# EAGLE design Jemuran (EAGLE 7.7.0)
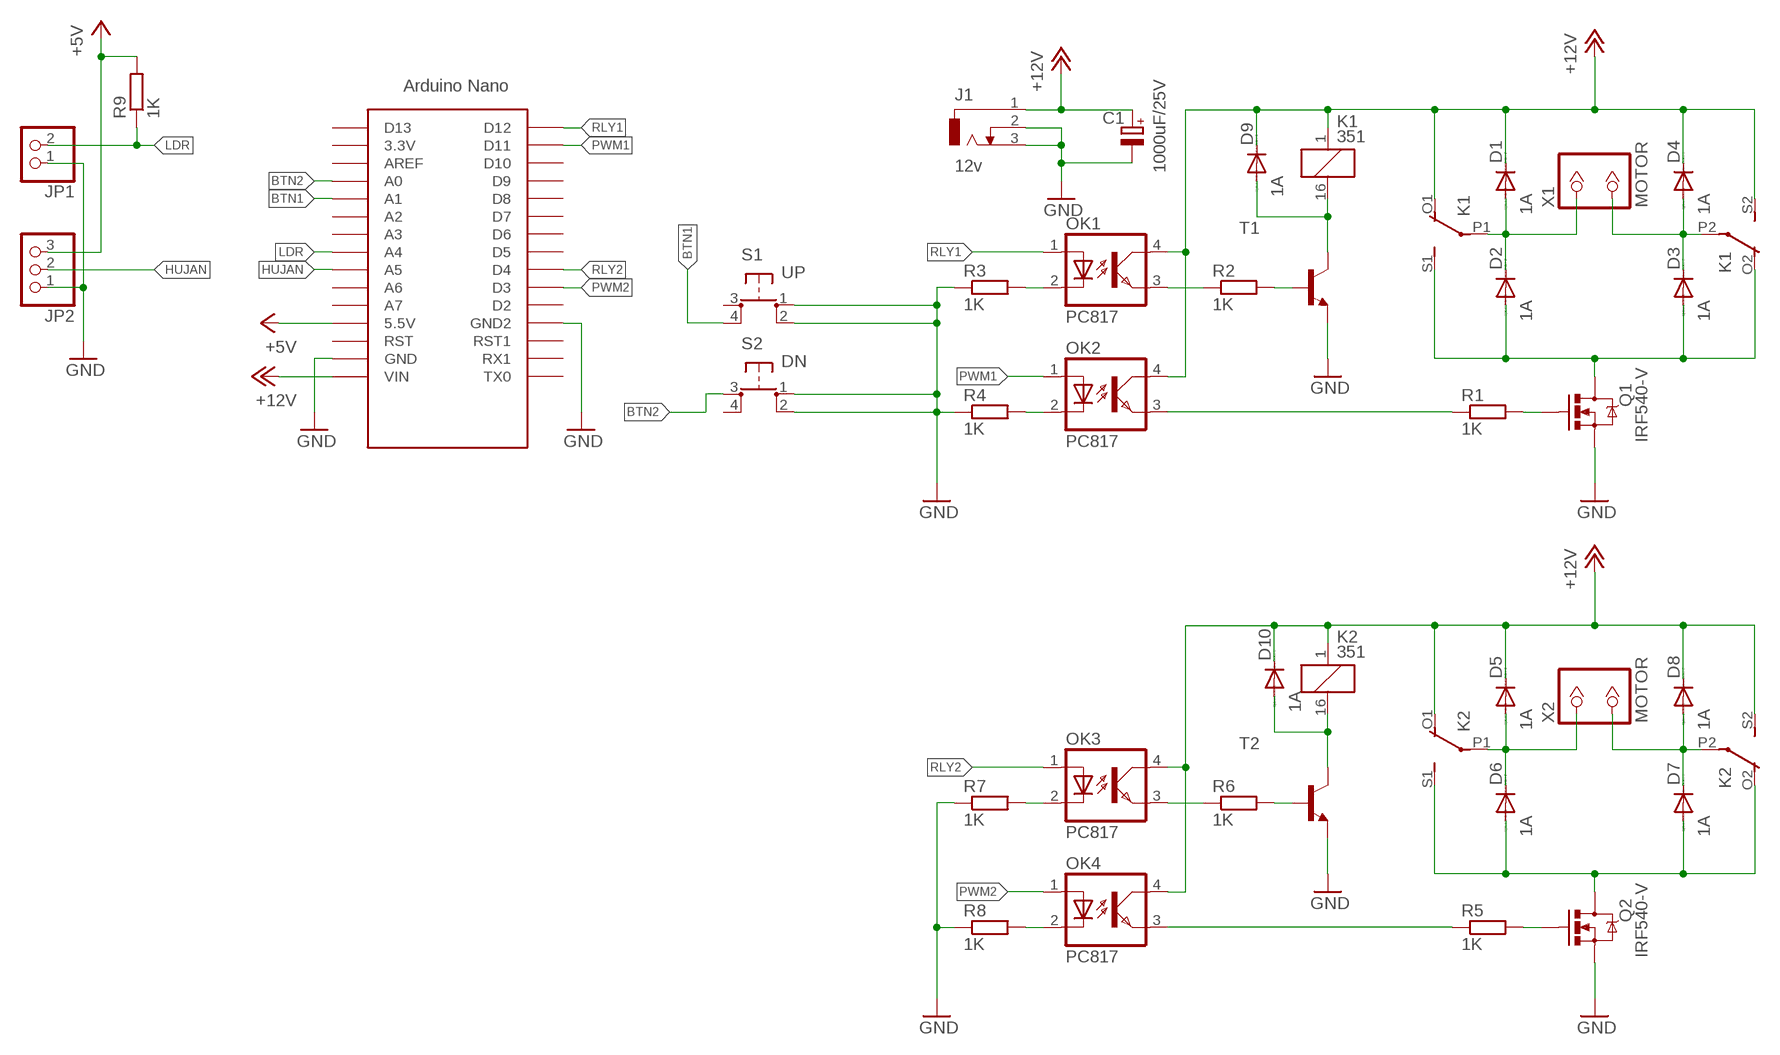
[diagram p0: schematic, sheet 1]

## Parts
C1  1000uF/25V  CPOL-EUE3.5-10  [E3,5-10]
D1  1A  DIODE-DIP-1A  [D40-10]
D2  1A  DIODE-DIP-1A  [D40-10]
D3  1A  DIODE-DIP-1A  [D40-10]
D4  1A  DIODE-DIP-1A  [D40-10]
D5  1A  DIODE-DIP-1A  [D40-10]
D6  1A  DIODE-DIP-1A  [D40-10]
D7  1A  DIODE-DIP-1A  [D40-10]
D8  1A  DIODE-DIP-1A  [D40-10]
D9  1A  DIODE-DIP-1A  [D40-10]
D10  1A  DIODE-DIP-1A  [D40-10]
J1  12v  JACK-PCB-ARDUINO  [JACK-PCB-ARDUINO]
JP1  PINHD-1X2  [1X02]
JP2  PINHD-1X3  [1X03]
K1  351  [351]
K2  351  [351]
OK1  PC817  [DIL04]
OK2  PC817  [DIL04]
OK3  PC817  [DIL04]
OK4  PC817  [DIL04]
Q1  IRF540-V  [TO220V]
Q2  IRF540-V  [TO220V]
R1  1K  R-EU_0207/7  [0207/7]
R2  1K  R-EU_0207/7  [0207/7]
R3  1K  R-EU_0207/7  [0207/7]
R4  1K  R-EU_0207/7  [0207/7]
R5  1K  R-EU_0207/7  [0207/7]
R6  1K  R-EU_0207/7  [0207/7]
R7  1K  R-EU_0207/7  [0207/7]
R8  1K  R-EU_0207/7  [0207/7]
R9  1K  R-EU_0207/7  [0207/7]
S1  UP  TACT-6X6OCT  [TACT-6X6MM-OCTAGON]
S2  DN  TACT-6X6OCT  [TACT-6X6MM-OCTAGON]
T1  -NPN-TO92-EBC  [TO92-EBC]
T2  -NPN-TO92-EBC  [TO92-EBC]
U$1  NANO  [NANO]
X1  MOTOR  2PIN-SCREW  [KL2]
X2  MOTOR  2PIN-SCREW  [KL2]

## Nets
+5V: JP2.3 R9.2 U$1.5V(5.5V)
+12V: C1.+ D1.C D4.C D5.C D8.C D9.C D10.C J1.1 K1.1 K1.O1(2:O) K1.S2(3:S) K2.1 K2.O1(2:O) K2.S2(3:S) OK1.4(COL) OK2.4(COL) OK3.4(COL) OK4.4(COL) U$1.VIN
BTN1: S1.4(P1) U$1.A1
BTN2: S2.3(P) U$1.A0
GND: C1.- J1.2 J1.3 JP1.1 JP2.1 Q1.3(S) Q2.3(S) R3.1 R4.1 R7.1 R8.1 S1.1(S) S1.2(S1) S2.1(S) S2.2(S1) T1.E T2.E U$1.GND U$1.GND1(GND2)
HUJAN: JP2.2 U$1.A5
LDR: JP1.2 R9.1 U$1.A4
N$1: Q1.1(G) R1.2
N$2: D2.A D3.A K1.O2(3:O) K1.S1(2:S) Q1.2(D)
N$3: D1.A D2.C K1.P1(2:P) X1.1
N$4: D3.C D4.A K1.P2(3:P) X1.2
N$5: OK2.3(EMIT) R1.1
N$6: D9.A K1.16 T1.C
N$7: R2.2 T1.B
N$8: OK1.2(C) R3.2
N$9: OK1.3(EMIT) R2.1
N$10: OK2.2(C) R4.2
N$11: D6.A D7.A K2.O2(3:O) K2.S1(2:S) Q2.2(D)
N$12: D5.A D6.C K2.P1(2:P) X2.1
N$13: D7.C D8.A K2.P2(3:P) X2.2
N$14: Q2.1(G) R5.2
N$15: OK4.3(EMIT) R5.1
N$16: D10.A K2.16 T2.C
N$17: R6.2 T2.B
N$18: OK3.3(EMIT) R6.1
N$19: OK3.2(C) R7.2
N$20: OK4.2(C) R8.2
PWM1: OK2.1(A) U$1.D11
PWM2: OK4.1(A) U$1.D3
RLY1: OK1.1(A) U$1.D12
RLY2: OK3.1(A) U$1.D4
Unconnected: S1.3(P) S2.4(P1) U$1.3.3V U$1.A2 U$1.A3 U$1.A6 U$1.A7 U$1.AREF U$1.D2 U$1.D5 U$1.D6 U$1.D7 U$1.D8 U$1.D9 U$1.D10 U$1.D13 U$1.RST U$1.RST1 U$1.RX1 U$1.TX0

## Library data of the parts
C1 = FansElectronics-RCL:CPOL-EU: POLARIZED CAPACITOR, European symbol
D1-D10 = FansElectronics-Diode:DIODE-DIP
J1 = FansElectronics-Con-Jack:JACK-PCB-ARDUINO: 2 Lubang PCB Jack
JP1 = FansElectronics-Header:PINHD-1X2: PIN HEADER
JP2 = FansElectronics-Header:PINHD-1X3: PIN HEADER
K1 K2 = relay:351: RELAY 2 x switch, Omron; OC_FARNELL: unknown; OC_NEWARK: unknown
OK1-OK4 = optocoupler:PC817: SHARP OPTO COUPLER; MPN: PC817X4J000F; OC_FARNELL: 9707727; OC_NEWARK: 97K7059
Q1 Q2 = FansElectronics-Mosfet:IRF540
R1-R9 = FansElectronics-RCL:R-EU_: RESISTOR, European symbol
S1 S2 = FansElectronics-Switch:TACT: TACT SWITCH biasa juga disebut Switch Omron / Micro Switch
T1 T2 = transistor:*-NPN-: NPN Transistror BF959 corrected 2008.03.06
U$1 = Arduino-clone:NANO: Arduino Nano
X1 X2 = FansElectronics-Con-Screw:2PIN

## Board
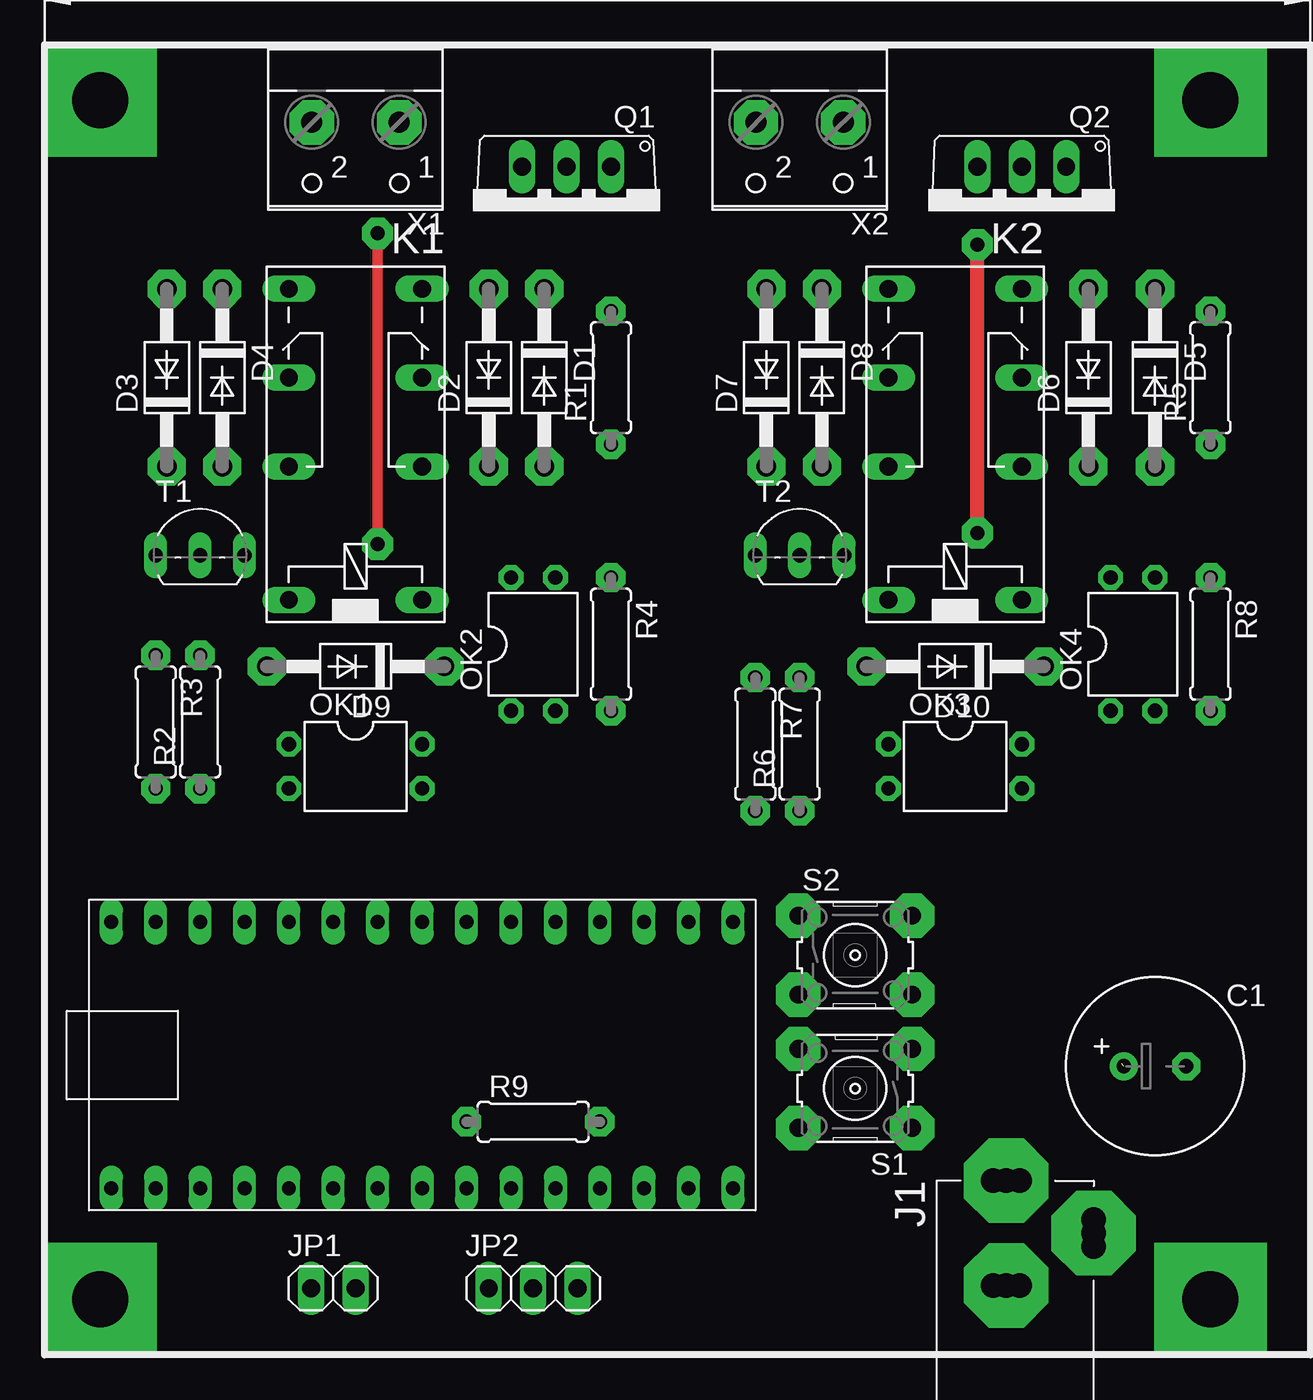
[diagram p1: board, top side]
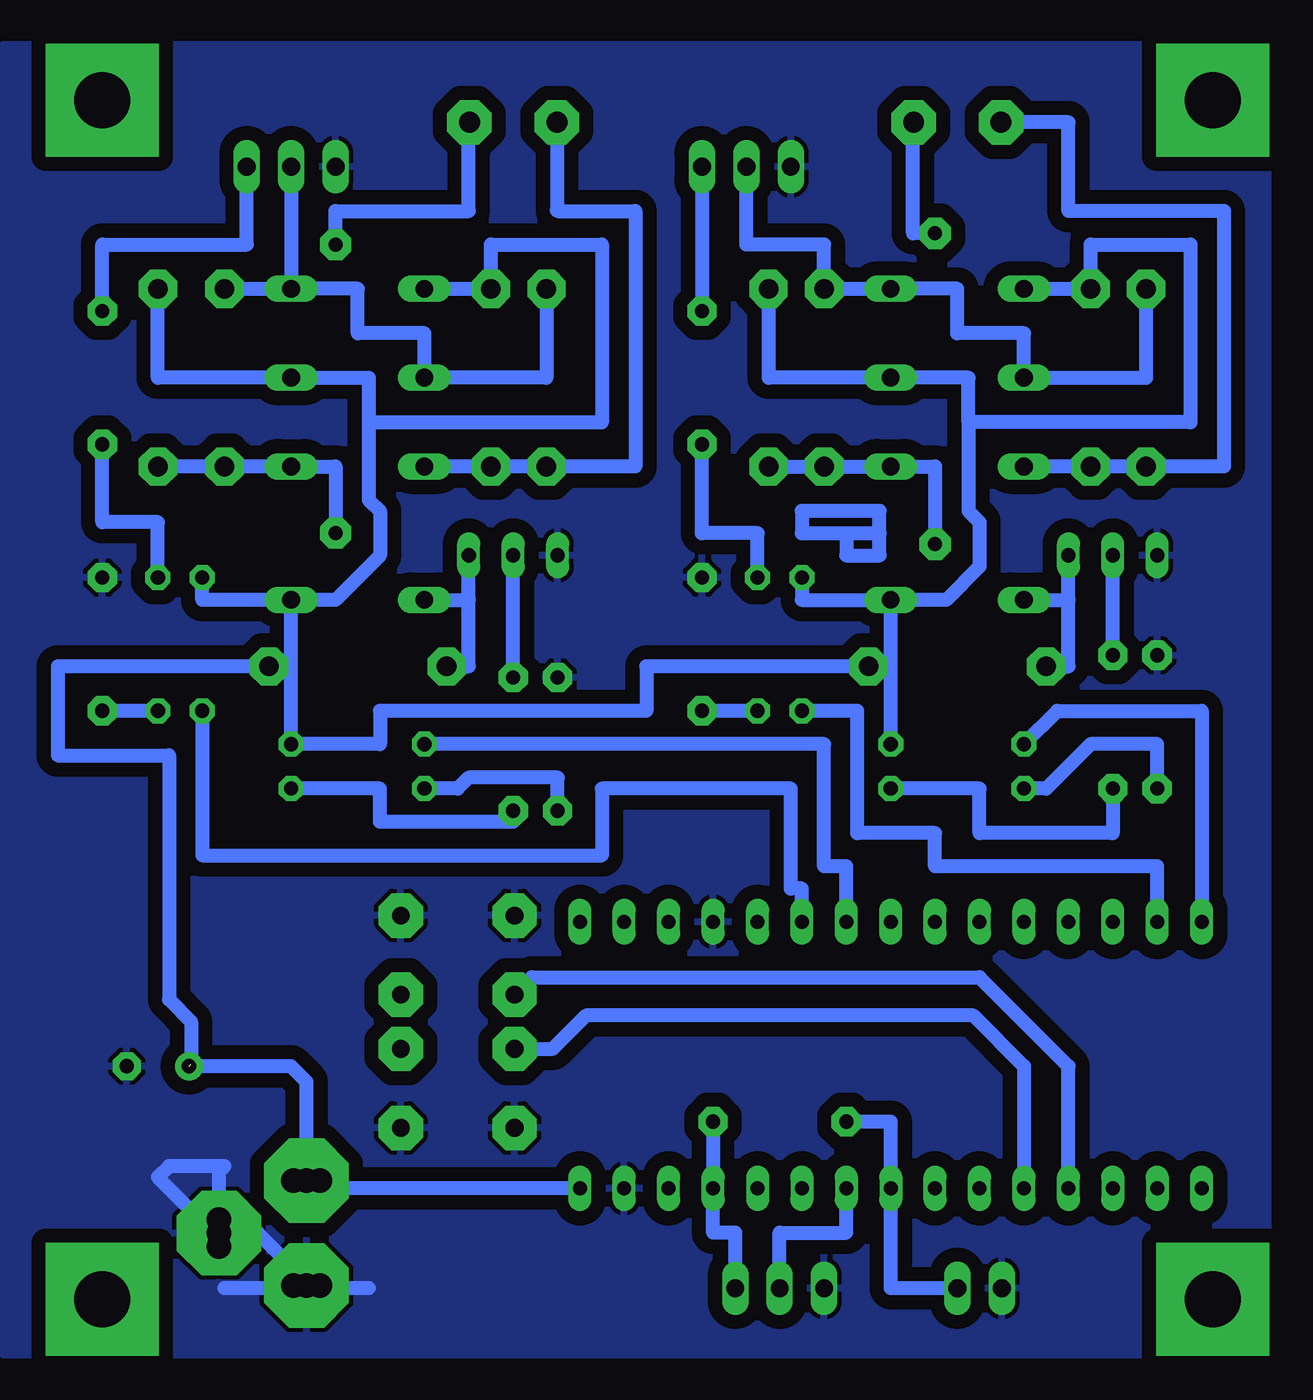
[diagram p2: board, bottom side, seen from below]

No outline drawn. Coordinates in mm, seen from the top.
Copper layers (1*16): Top 0.035mm / dielectric 1.5mm / Bottom 0.035mm
Design rules "default": minimum track width 10mil, minimum drill 24mil, track to track 8mil, track to pad 8mil, pad to pad 8mil, via to via 8mil, smd to smd 8mil, copper to edge 40mil, drill to drill 8mil, minimum pad ring 10mil, minimum via ring 8mil, stop-mask expansion 4mil, vias tented up to drill 0mil, thermal gap 10mil

### Footprints (pad centres in the part's own frame; a part is rotated, then mirrored left to right if it is on the bottom)
E3,5-10 = drill 0.813 pad 1.6: + -1.778,0 | drill 0.813 pad 1.6 octagon: - 1.778,0
D40-10 = drill 1.118 pad 2.184 octagon: A 5.08,0; C -5.08,0
JACK-PCB-ARDUINO = drill 1.4 pad 4.826 octagon: 1 -0.25,2.978; 2 4.754,-0.019; 3 -0.25,-3.016 | drill 1.4: 4 -1.012,2.978; 5 0.512,2.978; 6 4.754,0.743; 7 4.754,-0.781; 8 -1.012,-3.016; 9 0.512,-3.016
1X02 = drill 1.016 long: 1 -1.27,0; 2 1.27,0
1X03 = drill 1.016 long: 1 -2.54,0; 2 0,0; 3 2.54,0
351 = drill 1.016 long: 1 -3.81,-3.81; 16 -3.81,3.81; O1 8.89,-3.81; O2 8.89,3.81; P1 3.81,-3.81; P2 3.81,3.81; S1 13.97,-3.81; S2 13.97,3.81
DIL04 = drill 0.813 pad 1.422 octagon: 1 -1.27,-3.81; 2 1.27,-3.81; 3 1.27,3.81; 4 -1.27,3.81
TO220V = drill 1.016 long: 1 -2.54,0; 2 0,0; 3 2.54,0
0207/7 = drill 0.813 pad 1.676 octagon: 1 -3.81,0; 2 3.81,0
TACT-6X6MM-OCTAGON = drill 1.016 pad 2.54 octagon: 1 -3.251,2.261; 2 3.251,2.261; 3 -3.251,-2.261; 4 3.251,-2.261
TO92-EBC = drill 0.813 long: B 0,-1.27; C 2.54,-1.27; E -2.54,-1.27
NANO = drill 0.8 long: 3.3V -10.16,24.13; 5V -10.16,-1.27; A0 -10.16,19.05; A1 -10.16,16.51; A2 -10.16,13.97; A3 -10.16,11.43; A4 -10.16,8.89; A5 -10.16,6.35; A6 -10.16,3.81; A7 -10.16,1.27; AREF -10.16,21.59; D2 5.08,1.27; D3 5.08,3.81; D4 5.08,6.35; D5 5.08,8.89; D6 5.08,11.43; D7 5.08,13.97; D8 5.08,16.51; D9 5.08,19.05; D10 5.08,21.59; D11 5.08,24.13; D12 5.08,26.67; D13 -10.16,26.67; GND -10.16,-6.35; GND1 5.08,-1.27; RST -10.16,-3.81; RST1 5.08,-3.81; RX1 5.08,-6.35; TX0 5.08,-8.89; VIN -10.16,-8.89
KL2 = drill 1.194 pad 2.54 octagon: 1 -2.5,0; 2 2.5,0

### Placement (x,y rotation side)
C1  130.81,41.91 0 top
D1  95.89,81.28 270 top
D2  92.71,81.28 90 top
D3  74.3,81.28 90 top
D4  77.47,81.28 270 top
D5  130.81,81.28 270 top
D6  127,81.28 90 top
D7  108.58,81.28 90 top
D8  111.76,81.28 270 top
D9  85.09,64.77 180 top
D10  119.38,64.77 180 top
J1  122.56,32.38 0 top
JP1  83.82,29.21 0 top
JP2  95.25,29.21 0 top
K1  85.09,72.39 90 top
K2  119.38,72.39 90 top
OK1  85.09,59.05 270 top
OK2  95.25,66.04 0 top
OK3  119.38,59.05 270 top
OK4  129.54,66.04 0 top
Q1  97.16,93.34 180 top
Q2  123.19,93.34 180 top
R1  99.69,81.28 90 top
R2  76.2,61.59 90 top
R3  73.66,61.59 270 top
R4  99.69,66.04 270 top
R5  133.99,81.28 90 top
R6  110.49,60.33 90 top
R7  107.95,60.33 270 top
R8  133.99,66.04 270 top
R9  95.25,38.73 0 top
S1  113.67,40.64 180 top
S2  113.67,48.26 0 top
T1  76.2,72.39 0 top
T2  110.49,72.39 0 top
U$1  97.79,45.09 90 top
X1  85.09,95.89 180 top
X2  110.49,95.89 180 top

### Tracks (layer width: path | path; a pad name or v marks a point on that pad's centre or on a via)
+5V
  Bottom 0.813: R9.2 U$1.5V 99.06,32.38 97.79,32.38 JP2.3
+12V  (1 unrouted)
  Bottom 0.813: K1.S2 D4.C 77.47,88.9 71.75,88.9 71.75,78.74 84.45,78.74 | 84.45,78.74 84.45,81.28 K1.O1 95.89,81.28 D1.C | K2.S2 D8.C 111.76,88.9 105.41,88.9 105.41,78.74 118.75,78.74 | 118.75,78.74 118.75,81.28 K2.O1 130.81,81.28 D5.C | 84.45,78.74 84.45,73.66 83.82,73.03 83.82,70.48 85.72,68.58 K1.1 | OK1.4 88.9,64.77 | 88.9,64.77 K1.1 | OK2.4 93.98,68.58 K1.1 | 118.75,78.74 118.75,74.3 118.11,73.66 118.11,71.12 120.65,68.58 K2.1 | 123.19,64.77 K2.1 | 123.19,64.77 D10.C 136.53,64.77 136.53,59.69 130.18,59.69 130.18,45.72 128.91,44.45 128.91,42.04 | K2.1 128.27,68.58 OK4.4 | 88.9,64.77 D9.C 102.87,64.77 102.87,62.23 118.11,62.23 118.11,60.33 OK3.4 123.19,64.77 | U$1.VIN 121.87,34.92 J1.1 122.31,41.02 123.19,41.91 C1.+
BTN1
  Bottom 0.813: U$1.A1 81.28,41.91 84.18,44.81 106.32,44.81 108.23,42.9 S1.4
BTN2
  Bottom 0.813: U$1.A0 78.74,41.91 83.82,46.99 109.42,46.99 S2.3
GND
  Bottom 0.813: J1.3 122.31,29.59 125.09,32.38 127,32.38 127.29,32.38 | 127.29,32.38 J1.2 127.31,35.89 127,36.2 130.18,36.2 130.81,35.56 127.64,32.38 127.29,32.38 | 118.75,29.21 127,29.21
  pour Bottom (isolate 0.813): 67.31,100.33 139.7,100.33 139.7,25.4 67.31,25.4
HUJAN
  Bottom 0.813: JP2.2 95.25,32.38 91.44,32.38 U$1.A5
LDR
  Bottom 0.813: JP1.2 88.9,29.21 U$1.A4 88.9,38.73 R9.1
N$1
  Bottom 0.813: Q1.1 R1.2
N$2
  Bottom 0.813: D3.A 74.3,81.28 K1.O2 81.28,83.82 85.09,83.82 85.09,86.36 K1.S1 D2.A 92.71,88.9 97.16,88.9 Q1.2
N$3  (via drill 0.8 pad 1.78)
  Top 0.61: v86.36,71.75 v86.36,89.53
  Bottom 0.813: D1.A D2.C K1.P1 86.36,76.2 v86.36,71.75 | v86.36,89.53 87.63,89.53 87.63,95.84 X1.1
N$4
  Bottom 0.813: X1.2 78.74,95.89 78.74,90.81 69.85,90.81 69.85,76.2 D3.C D4.A K1.P2
N$5
  Bottom 0.813: OK2.3 96.52,72.39 99.69,72.39 R1.1
N$6
  Bottom 0.813: D9.A 78.74,64.77 78.74,68.58 | 78.74,68.58 T1.C | K1.16 78.74,68.58
N$7
  Bottom 0.813: R2.2 T1.B
N$8
  Bottom 0.813: R3.2 73.66,60.33 77.47,60.33 80.01,57.78 OK1.2
N$9
  Bottom 0.813: R2.1 76.2,55.24 83.82,55.24 83.82,57.78 OK1.3
N$10
  Bottom 0.813: OK2.2 R4.2
N$11
  Bottom 0.813: D7.A 108.58,81.28 K2.O2 115.57,83.82 119.38,83.82 119.38,86.36 K2.S1 | Q2.2 K2.S1 | D6.A K2.S1
N$12  (via drill 0.8 pad 1.78)
  Top 0.813: v120.65,72.39 v120.65,88.9
  Bottom 0.813: v120.65,72.39 120.65,76.2 K2.P1 D6.C D5.A | v120.65,88.9 120.65,90.81 113.03,90.81 113.03,95.84 X2.1
N$13
  Bottom 0.813: X2.2 107.99,90.84 107.95,90.81 103.5,90.81 103.5,76.2 D7.C D8.A K2.P2
N$14
  Bottom 0.813: R5.2 133.99,88.9 125.73,88.9 Q2.1
N$15
  Bottom 0.813: OK4.3 130.81,73.03 133.99,73.03 R5.1
N$16
  Bottom 0.813: D10.A 113.03,64.77 113.03,68.58 | 113.03,68.58 T2.C | K2.16 113.03,68.58
N$17
  Bottom 0.813: R6.2 T2.B
N$18
  Bottom 0.813: R6.1 110.49,55.88 118.11,55.88 118.11,57.78 OK3.3
N$19
  Bottom 0.813: R7.2 107.95,58.42 113.03,58.42 113.67,57.78 OK3.2
N$20
  Bottom 0.813: OK4.2 R8.2
N$21  (via drill 3.2 pad 6.45)
  other vias: 70.48,28.57
N$22  (via drill 3.2 pad 6.45)
  other vias: 133.99,97.16
N$23  (via drill 3.2 pad 6.45)
  other vias: 70.48,97.16
N$24  (via drill 3.2 pad 6.45)
  other vias: 133.99,28.57
N$25
  Bottom 0.813: 91.44,72.39 93.98,72.39 93.98,73.66 89.53,73.66 89.53,72.39 | 91.44,72.39 89.53,72.39 | 91.44,72.39 91.44,71.12 89.53,71.12 89.53,72.39
PWM1
  Bottom 0.813: U$1.D11 73.66,53.34 86.36,53.34 86.36,55.24 90.81,55.24 90.81,62.23 OK2.1
PWM2
  Bottom 0.813: U$1.D3 93.98,52.07 94.61,52.07 94.61,57.78 105.41,57.78 105.41,53.98 128.27,53.98 OK4.1
RLY1
  Bottom 0.813: OK1.1 79.38,62.23 71.12,62.23 U$1.D12
RLY2
  Bottom 0.813: U$1.D4 91.44,53.34 92.71,53.34 92.71,60.33 OK3.1